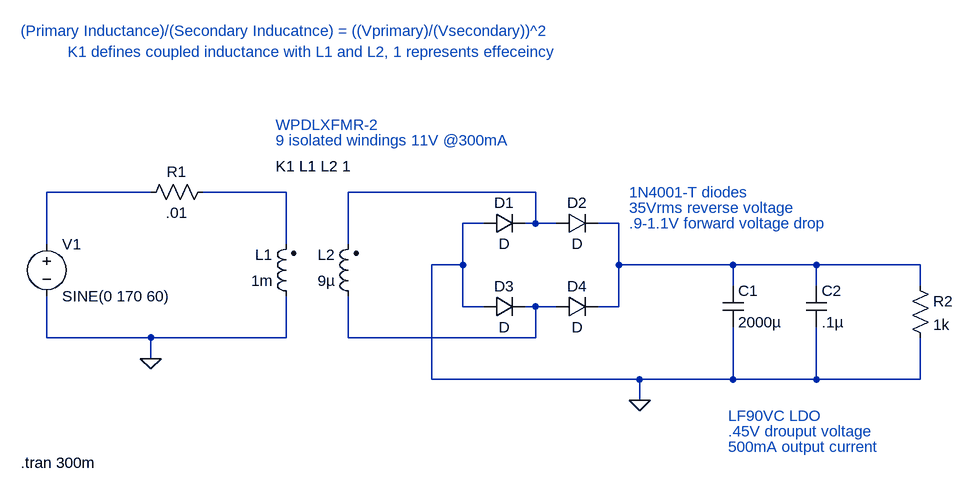
[diagram p0: schematic Transfomer and full bridge rectifier.asc]
Transfomer and full bridge rectifier.asc, the LTspice schematic file:
Version 4
SHEET 1 1272 680
WIRE 32 192 -128 192
WIRE 240 192 112 192
WIRE 624 192 336 192
WIRE 544 240 512 240
WIRE 624 240 624 192
WIRE 624 240 608 240
WIRE 656 240 624 240
WIRE 752 240 720 240
WIRE -128 272 -128 192
WIRE 240 272 240 192
WIRE 336 272 336 192
WIRE 512 304 512 240
WIRE 512 304 464 304
WIRE 752 304 752 240
WIRE 928 304 752 304
WIRE 1056 304 928 304
WIRE 1216 304 1056 304
WIRE 928 336 928 304
WIRE 1056 336 1056 304
WIRE 1216 336 1216 304
WIRE 512 368 512 304
WIRE 544 368 512 368
WIRE 624 368 608 368
WIRE 656 368 624 368
WIRE 752 368 752 304
WIRE 752 368 720 368
WIRE -128 416 -128 352
WIRE 32 416 -128 416
WIRE 240 416 240 352
WIRE 240 416 32 416
WIRE 336 416 336 352
WIRE 624 416 624 368
WIRE 624 416 336 416
WIRE 32 448 32 416
WIRE 464 480 464 304
WIRE 784 480 464 480
WIRE 928 480 928 400
WIRE 928 480 784 480
WIRE 1056 480 1056 400
WIRE 1056 480 928 480
WIRE 1216 480 1216 416
WIRE 1216 480 1056 480
WIRE 784 512 784 480
FLAG 784 512 0
FLAG 32 448 0
SYMBOL res 128 176 R90
WINDOW 0 0 56 VBottom 2
WINDOW 3 32 56 VTop 2
SYMATTR InstName R1
SYMATTR Value .01
SYMBOL voltage -128 256 R0
WINDOW 123 0 0 Left 0
WINDOW 39 0 0 Left 0
SYMATTR InstName V1
SYMATTR Value SINE(0 170 60)
SYMBOL ind2 256 368 R180
WINDOW 0 36 80 Left 2
WINDOW 3 36 40 Left 2
SYMATTR InstName L1
SYMATTR Value 1m
SYMATTR Type ind
SYMBOL ind2 352 368 R180
WINDOW 0 36 80 Left 2
WINDOW 3 36 40 Left 2
SYMATTR InstName L2
SYMATTR Value 9µ
SYMATTR Type ind
SYMBOL diode 544 256 R270
WINDOW 0 32 32 VTop 2
WINDOW 3 0 32 VBottom 2
SYMATTR InstName D1
SYMBOL diode 656 256 R270
WINDOW 0 32 32 VTop 2
WINDOW 3 0 32 VBottom 2
SYMATTR InstName D2
SYMBOL diode 544 384 R270
WINDOW 0 32 32 VTop 2
WINDOW 3 0 32 VBottom 2
SYMATTR InstName D3
SYMBOL diode 656 384 R270
WINDOW 0 32 32 VTop 2
WINDOW 3 0 32 VBottom 2
SYMATTR InstName D4
SYMBOL cap 912 336 R0
SYMATTR InstName C1
SYMATTR Value 2000µ
SYMBOL cap 1040 336 R0
SYMATTR InstName C2
SYMATTR Value .1µ
SYMBOL res 1200 320 R0
SYMATTR InstName R2
SYMATTR Value 1k
TEXT 224 152 Left 2 !K1 L1 L2 1
TEXT 224 88 Left 2 ;WPDLXFMR-2
TEXT 224 112 Left 2 ;9 isolated windings 11V @300mA
TEXT -168 -56 Left 2 ;(Primary Inductance)/(Secondary Inducatnce) = ((Vprimary)/(Vsecondary))^2
TEXT -96 -24 Left 2 ;K1 defines coupled inductance with L1 and L2, 1 represents effeceincy
TEXT 768 192 Left 2 ;1N4001-T diodes
TEXT 768 216 Left 2 ;35Vrms reverse voltage
TEXT 768 240 Left 2 ;.9-1.1V forward voltage drop
TEXT 920 536 Left 2 ;LF90VC LDO
TEXT 920 560 Left 2 ;.45V drouput voltage
TEXT 920 584 Left 2 ;500mA output current
TEXT -168 608 Left 2 !.tran 300m

The netlist it stands for:
* Transfomer and full bridge rectifier.asc
R1 N002 N001 .01
V1 N001 0 SINE(0 170 60)
L1 0 N002 1m
L2 N005 N003 9µ
D1 0 N003 D
D2 N003 N004 D
D3 0 N005 D
D4 N005 N004 D
C1 N004 0 2000µ
C2 N004 0 .1µ
R2 N004 0 1k
.model D D
.lib standard.dio
K1 L1 L2 1
* WPDLXFMR-2
* 9 isolated windings 11V @300mA
* (Primary Inductance)/(Secondary Inducatnce) = ((Vprimary)/(Vsecondary))^2
* K1 defines coupled inductance with L1 and L2, 1 represents effeceincy
* 1N4001-T diodes
* 35Vrms reverse voltage
* .9-1.1V forward voltage drop
* LF90VC LDO
* .45V drouput voltage
* 500mA output current
.tran 300m
.backanno
.end